# Altium schematic sheet BackplaneConnector.SchDoc
size B
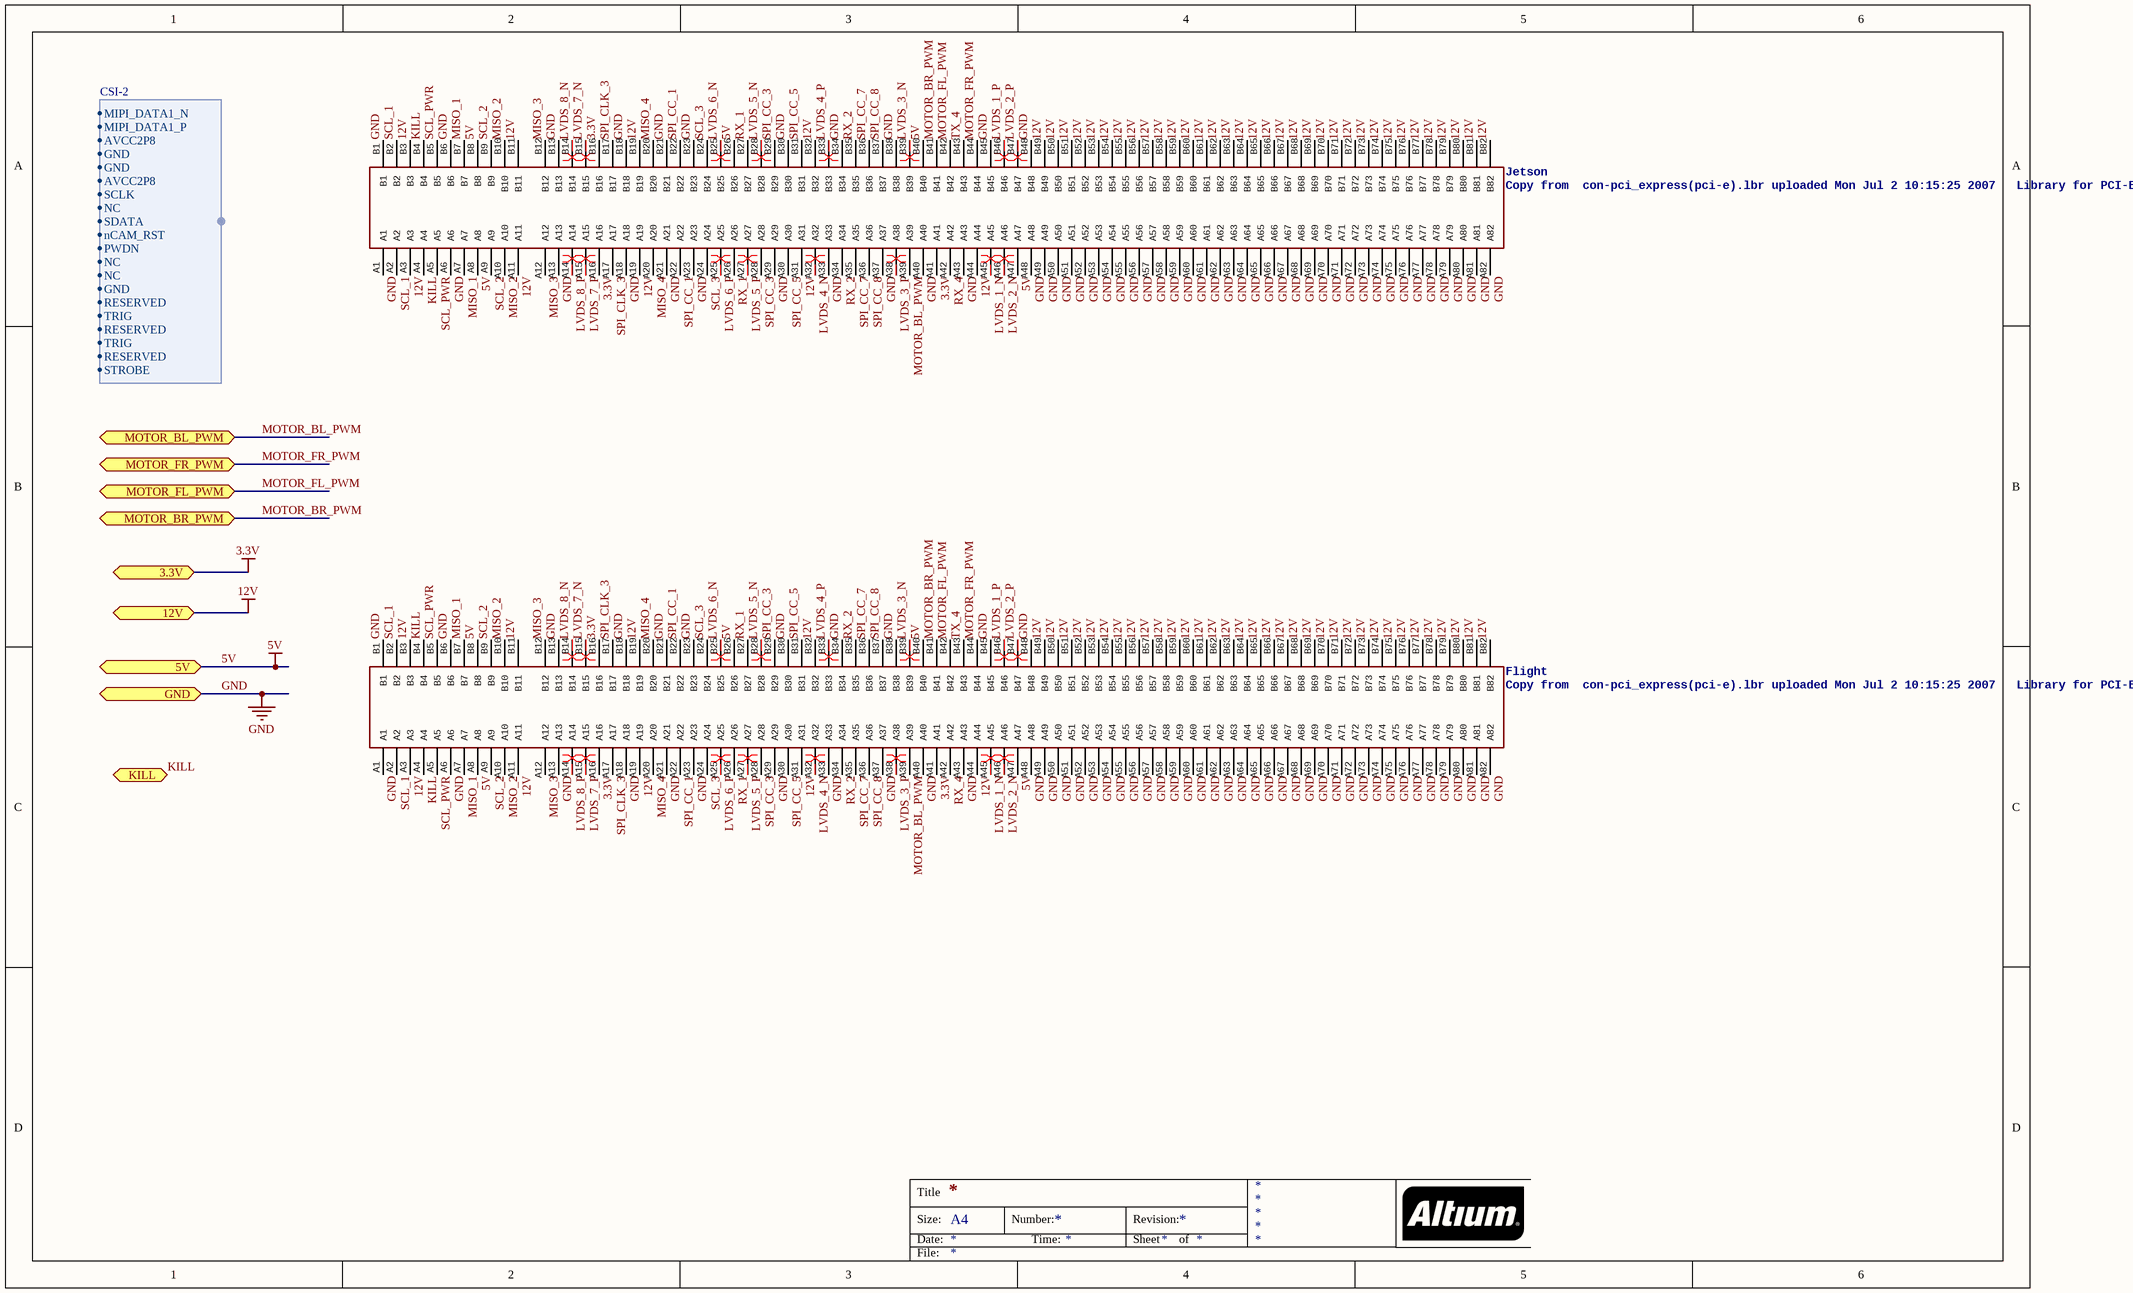
[diagram p0: BackplaneConnector.SchDoc]

## Parts
Flight  Copy from  con-pci_express(pci-e).lbr uploaded Mon Jul 2 10:15:25 2007   Library for PCI-Express x16 (PCI-E) connector. Includes connector and card edge pattern. Uploaded by JF Duval <jfduval@aqra.ca> from AQRA.ca  [PCI-E-164]
Jetson  Copy from  con-pci_express(pci-e).lbr uploaded Mon Jul 2 10:15:25 2007   Library for PCI-Express x16 (PCI-E) connector. Includes connector and card edge pattern. Uploaded by JF Duval <jfduval@aqra.ca> from AQRA.ca  [PCI-E-164]

## Ports
3.3V, 5V, 12V, GND, KILL, MOTOR_BL_PWM, MOTOR_BR_PWM, MOTOR_FL_PWM, MOTOR_FR_PWM

## Harnesses
CSI-2: AVCC2P8, MIPI_DATA1_N, MIPI_DATA1_P, AVCC2P8, GND, GND, SCLK, NC, SDATA, nCAM_RST, PWDN, NC, NC, GND, RESERVED, TRIG, RESERVED, TRIG, RESERVED, STROBE

## Nets
3.3V: Flight.A16 Flight.A41 Flight.B16 Jetson.A16 Jetson.A41 Jetson.B16 ; port 3.3V
5V: Flight.A8 Flight.A47 Flight.B8 Flight.B26 Flight.B40 Jetson.A8 Jetson.A47 Jetson.B8 Jetson.B26 Jetson.B40 ; port 5V
12V: Flight.A3 Flight.A11 Flight.A19 Flight.A31 Flight.A44 Flight.B3 Flight.B11 Flight.B19 Flight.B32 Flight.B49 Flight.B50 Flight.B51 Flight.B52 Flight.B53 Flight.B54 Flight.B55 Flight.B56 Flight.B57 Flight.B58 Flight.B59 Flight.B60 Flight.B61 Flight.B62 Flight.B63 Flight.B64 Flight.B65 Flight.B66 Flight.B67 Flight.B68 Flight.B69 Flight.B70 Flight.B71 Flight.B72 Flight.B73 Flight.B74 Flight.B75 Flight.B76 Flight.B77 Flight.B78 Flight.B79 Flight.B80 Flight.B81 Flight.B82 Jetson.A3 Jetson.A11 Jetson.A19 Jetson.A31 Jetson.A44 Jetson.B3 Jetson.B11 Jetson.B19 Jetson.B32 Jetson.B49 Jetson.B50 Jetson.B51 Jetson.B52 Jetson.B53 Jetson.B54 Jetson.B55 Jetson.B56 Jetson.B57 Jetson.B58 Jetson.B59 Jetson.B60 Jetson.B61 Jetson.B62 Jetson.B63 Jetson.B64 Jetson.B65 Jetson.B66 Jetson.B67 Jetson.B68 Jetson.B69 Jetson.B70 Jetson.B71 Jetson.B72 Jetson.B73 Jetson.B74 Jetson.B75 Jetson.B76 Jetson.B77 Jetson.B78 Jetson.B79 Jetson.B80 Jetson.B81 Jetson.B82 ; port 12V
GND: Flight.A1 Flight.A6 Flight.A13 Flight.A18 Flight.A21 Flight.A23 Flight.A29 Flight.A33 Flight.A37 Flight.A40 Flight.A43 Flight.A48 Flight.A49 Flight.A50 Flight.A51 Flight.A52 Flight.A53 Flight.A54 Flight.A55 Flight.A56 Flight.A57 Flight.A58 Flight.A59 Flight.A60 Flight.A61 Flight.A62 Flight.A63 Flight.A64 Flight.A65 Flight.A66 Flight.A67 Flight.A68 Flight.A69 Flight.A70 Flight.A71 Flight.A72 Flight.A73 Flight.A74 Flight.A75 Flight.A76 Flight.A77 Flight.A78 Flight.A79 Flight.A80 Flight.A81 Flight.A82 Flight.B1 Flight.B6 Flight.B13 Flight.B18 Flight.B21 Flight.B23 Flight.B30 Flight.B34 Flight.B38 Flight.B45 Flight.B48 Jetson.A1 Jetson.A6 Jetson.A13 Jetson.A18 Jetson.A21 Jetson.A23 Jetson.A29 Jetson.A33 Jetson.A37 Jetson.A40 Jetson.A43 Jetson.A48 Jetson.A49 Jetson.A50 Jetson.A51 Jetson.A52 Jetson.A53 Jetson.A54 Jetson.A55 Jetson.A56 Jetson.A57 Jetson.A58 Jetson.A59 Jetson.A60 Jetson.A61 Jetson.A62 Jetson.A63 Jetson.A64 Jetson.A65 Jetson.A66 Jetson.A67 Jetson.A68 Jetson.A69 Jetson.A70 Jetson.A71 Jetson.A72 Jetson.A73 Jetson.A74 Jetson.A75 Jetson.A76 Jetson.A77 Jetson.A78 Jetson.A79 Jetson.A80 Jetson.A81 Jetson.A82 Jetson.B1 Jetson.B6 Jetson.B13 Jetson.B18 Jetson.B21 Jetson.B23 Jetson.B30 Jetson.B34 Jetson.B38 Jetson.B45 Jetson.B48 ; port GND
KILL: Flight.A4 Flight.B4 Jetson.A4 Jetson.B4 ; port KILL
LVDS_1_N: Flight.A45 Jetson.A45
LVDS_1_P: Flight.B46 Jetson.B46
LVDS_2_N: Flight.A46 Jetson.A46
LVDS_2_P: Flight.B47 Jetson.B47
LVDS_3_N: Flight.B39 Jetson.B39
LVDS_3_P: Flight.A38 Jetson.A38
LVDS_4_N: Flight.A32 Jetson.A32
LVDS_4_P: Flight.B33 Jetson.B33
LVDS_5_N: Flight.B28 Jetson.B28
LVDS_5_P: Flight.A27 Jetson.A27
LVDS_6_N: Flight.B25 Jetson.B25
LVDS_6_P: Flight.A25 Jetson.A25
LVDS_7_N: Flight.B15 Jetson.B15
LVDS_7_P: Flight.A15 Jetson.A15
LVDS_8_N: Flight.B14 Jetson.B14
LVDS_8_P: Flight.A14 Jetson.A14
MISO_1: Flight.A7 Flight.B7 Jetson.A7 Jetson.B7
MISO_2: Flight.A10 Flight.B10 Jetson.A10 Jetson.B10
MISO_3: Flight.A12 Flight.B12 Jetson.A12 Jetson.B12
MISO_4: Flight.A20 Flight.B20 Jetson.A20 Jetson.B20
MOTOR_BL_PWM: Flight.A39 Jetson.A39 ; port MOTOR_BL_PWM
MOTOR_BR_PWM: Flight.B41 Jetson.B41 ; port MOTOR_BR_PWM
MOTOR_FL_PWM: Flight.B42 Jetson.B42 ; port MOTOR_FL_PWM
MOTOR_FR_PWM: Flight.B44 Jetson.B44 ; port MOTOR_FR_PWM
RX_1: Flight.A26 Flight.B27 Jetson.A26 Jetson.B27
RX_2: Flight.A34 Flight.B35 Jetson.A34 Jetson.B35
RX_4: Flight.A42 Jetson.A42
SCL_1: Flight.A2 Flight.B2 Jetson.A2 Jetson.B2
SCL_2: Flight.A9 Flight.B9 Jetson.A9 Jetson.B9
SCL_3: Flight.A24 Flight.B24 Jetson.A24 Jetson.B24
SCL_PWR: Flight.A5 Flight.B5 Jetson.A5 Jetson.B5
SPI_CC_1: Flight.A22 Flight.B22 Jetson.A22 Jetson.B22
SPI_CC_3: Flight.A28 Flight.B29 Jetson.A28 Jetson.B29
SPI_CC_5: Flight.A30 Flight.B31 Jetson.A30 Jetson.B31
SPI_CC_7: Flight.A35 Flight.B36 Jetson.A35 Jetson.B36
SPI_CC_8: Flight.A36 Flight.B37 Jetson.A36 Jetson.B37
SPI_CLK_3: Flight.A17 Flight.B17 Jetson.A17 Jetson.B17
TX_4: Flight.B43 Jetson.B43

## Layout directives
differential pair: LVDS_1_N, LVDS_1_P, LVDS_2_N, LVDS_2_P, LVDS_3_N, LVDS_3_P, LVDS_4_N, LVDS_4_P, LVDS_5_N, LVDS_5_P, LVDS_6_N, LVDS_6_P, LVDS_7_N, LVDS_7_P, LVDS_8_N, LVDS_8_P

## Notes on the sheet
- Title
- Size:
- Date:
- A4
- Number:
- Time:
- Revision:
- Sheet
- of
- File:

## Library data of the parts
Flight Jetson = PCI-E-164SOCKET